# Altium schematic sheet FMC_Power_Module.SchDoc: Front panel connectors, Jumpers, Mounting holes, and Fiducials
size A4; Date: 20.05.2022; ApprovedBy: PFH; CompanyName: IAM Electronic GmbH; DrawnBy: PFH; Engineer: PFH; Revision: A; SheetNumber: 1; SheetTotal: 6; Projekt: FMC Power Module; Website: www.fmchub.com
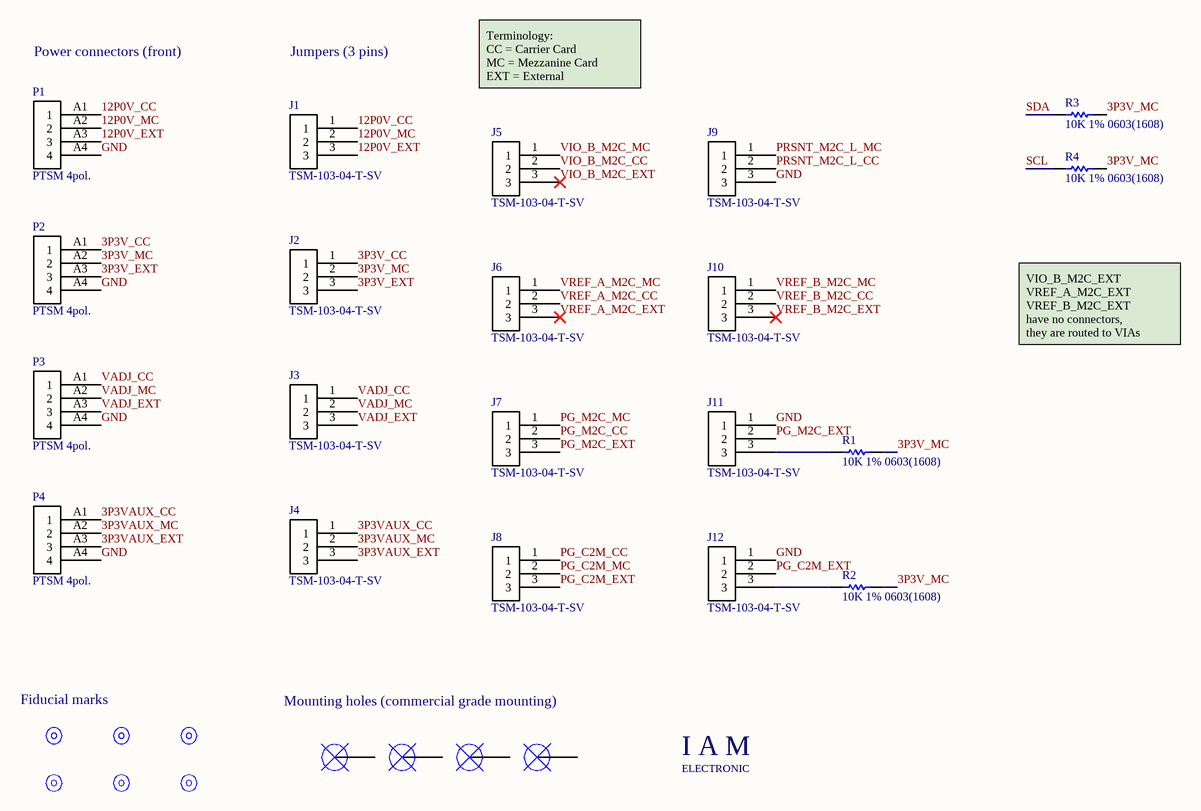
[diagram p0: FMC_Power_Module.SchDoc]

## Parts
FM1  1mm  [FIDUCIAL_MARK_ROUND_RING]  (value not drawn)  (no BOM)
FM2  1mm  [FIDUCIAL_MARK_ROUND_RING]  (value not drawn)  (no BOM)
FM3  1mm  [FIDUCIAL_MARK_ROUND_RING]  (value not drawn)  (no BOM)
FM4  1mm  [FIDUCIAL_MARK_ROUND_RING]  (value not drawn)  (no BOM)
FM5  1mm  [FIDUCIAL_MARK_ROUND_RING]  (value not drawn)  (no BOM)
FM6  1mm  [FIDUCIAL_MARK_ROUND_RING]  (value not drawn)  (no BOM)
J1  TSM-103-04-T-SV  [TSM-103-04-T-SV]
J2  TSM-103-04-T-SV  [TSM-103-04-T-SV]
J3  TSM-103-04-T-SV  [TSM-103-04-T-SV]
J4  TSM-103-04-T-SV  [TSM-103-04-T-SV]
J5  TSM-103-04-T-SV  [TSM-103-04-T-SV]
J6  TSM-103-04-T-SV  [TSM-103-04-T-SV]
J7  TSM-103-04-T-SV  [TSM-103-04-T-SV]
J8  TSM-103-04-T-SV  [TSM-103-04-T-SV]
J9  TSM-103-04-T-SV  [TSM-103-04-T-SV]
J10  TSM-103-04-T-SV  [TSM-103-04-T-SV]
J11  TSM-103-04-T-SV  [TSM-103-04-T-SV]
J12  TSM-103-04-T-SV  [TSM-103-04-T-SV]
MH1  2.2mm  [Mounting_Hole_2.2mm]  (value not drawn)  (no BOM)
MH2  2.2mm  [Mounting_Hole_2.2mm]  (value not drawn)  (no BOM)
MH3  2.7mm  [Mounting_Hole_Plated_2.7mm-COVERED]  (value not drawn)  (no BOM)
MH4  2.7mm  [Mounting_Hole_Plated_2.7mm-COVERED]  (value not drawn)  (no BOM)
P1  PTSM 4pol.  [PTSM-4pol]
P2  PTSM 4pol.  [PTSM-4pol]
P3  PTSM 4pol.  [PTSM-4pol]
P4  PTSM 4pol.  [PTSM-4pol]
R1  10K 1% 0603(1608)  [RESC0603(1608)_N]
R2  10K 1% 0603(1608)  [RESC0603(1608)_N]
R3  10K 1% 0603(1608)  [RESC0603(1608)_N]
R4  10K 1% 0603(1608)  [RESC0603(1608)_N]
STR1  IAM LOGO  [IAM LOGO - LARGE - WWW]  (value not drawn)  (no BOM)

## Nets
3P3V_CC: J2.1 P2.A1(1)
3P3V_EXT: J2.3 P2.A3(3)
3P3V_MC: J2.2 P2.A2(2) R1.2 R2.2 R3.2 R4.2
3P3VAUX_CC: J4.1 P4.A1(1)
3P3VAUX_EXT: J4.3 P4.A3(3)
3P3VAUX_MC: J4.2 P4.A2(2)
12P0V_CC: J1.1 P1.A1(1)
12P0V_EXT: J1.3 P1.A3(3)
12P0V_MC: J1.2 P1.A2(2)
GND: J9.3 J11.1 J12.1 P1.A4(4) P2.A4(4) P3.A4(4) P4.A4(4)
PG_C2M_CC: J8.1
PG_C2M_EXT: J8.3 J12.2
PG_C2M_MC: J8.2
PG_M2C_CC: J7.2
PG_M2C_EXT: J7.3 J11.2
PG_M2C_MC: J7.1
PRSNT_M2C_L_CC: J9.2
PRSNT_M2C_L_MC: J9.1
SCL: R4.1
SDA: R3.1
VADJ_CC: J3.1 P3.A1(1)
VADJ_EXT: J3.3 P3.A3(3)
VADJ_MC: J3.2 P3.A2(2)
VIO_B_M2C_CC: J5.2
VIO_B_M2C_EXT: J5.3
VIO_B_M2C_MC: J5.1
VREF_A_M2C_CC: J6.2
VREF_A_M2C_EXT: J6.3
VREF_A_M2C_MC: J6.1
VREF_B_M2C_CC: J10.2
VREF_B_M2C_EXT: J10.3
VREF_B_M2C_MC: J10.1
NetJ11_3: J11.3 R1.1
NetJ12_3: J12.3 R2.1

Not connected (* = marked no-connect by the designer): FM1 FD0; FM2 FD0; FM3 FD0; FM4 FD0; FM5 FD0; FM6 FD0; MH1 0; MH2 0; MH3 0; MH4 0

## Notes on the sheet
- Power connectors (front)
- Jumpers (3 pins)
- Terminology:
  CC = Carrier Card
  MC = Mezzanine Card
  EXT = External
- VIO_B_M2C_EXT
  VREF_A_M2C_EXT
  VREF_B_M2C_EXT
  have no connectors,
  they are routed to VIAs
- Fiducial marks
- Mounting holes (commercial grade mounting)
- Title:
- Project:
- Date:
- Website:
- Rev:
- Engineer:
- Sheet:
- /
- (in symbol IAM_LOGO) I A M; ELECTRONIC

## Library data of the parts
FM1-FM6 = Fiducial_Mark: Fiducial mark, width 1mm, clearance 3mm; Width: 1 mm; Clearance: 3 mm
J1-J12 = TSM-103-04-T-SV: .100" (2.54 mm) pitch 3 pin header, 0.27" (6.86 mm) total height, SMT; Manufacturer: Samtec; Part: TSM-103-04-T-SV
MH1 MH2 = Mounting_Hole_2.2mm: Mounting hole, hole size 2.2mm; Hole radius: 2.2 mm; Diameter (plated): *; Keep out (radius): *; Plated: *
MH3 MH4 = Mounting_Hole_2.7mm: Mounting hole, hole size 2.7mm; Hole radius: 2.7 mm; Diameter (plated): *; Keep out (radius): *; Plated: *
P1-P4 = PC-PTSM-4pol: Phoenix Contact PTSM SMT connector; Part: 1814650; Manufacturer: Phoenix Contact
R1-R4 = CMP-1012-00623-1: 10K 0603 (1608 Metric)  SMD; Part: WR06X1002FTL; Manufacturer: Walsin; Power: 0.1 W; Value: 10000.00 Ohm; Case-EIA: 0603; Case-Metric: 1608; Tolerance: 1 %; Technology: SMT
STR1 = IAM_LOGO: I A M E L E C T R O N I C - Logo; Layer: Top Overlay; Manufacturer: IAM ELECTRONIC; Part: Logo